# EAGLE design CANBUS Breakout Board (EAGLE 9.6.2)
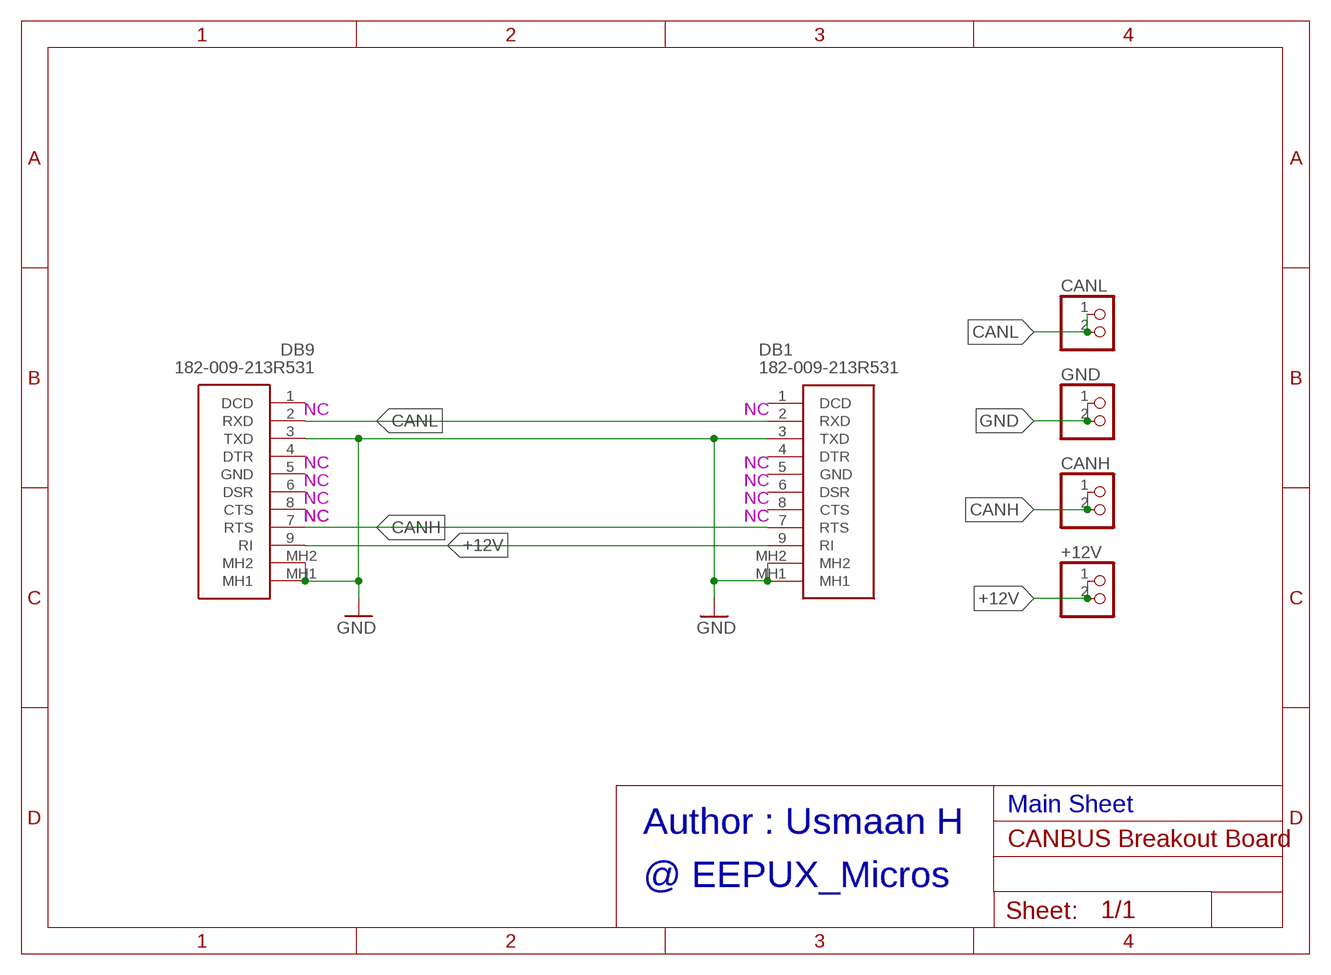
[diagram p0: schematic, sheet 1]

## Parts
+12V  PINHD-1X2  [1X02]
CANH  PINHD-1X2  [1X02]
CANL  PINHD-1X2  [1X02]
DB1  182-009-213R531  [182009213R531]
DB9  182-009-213R531  [182009213R531]
GND  PINHD-1X2  [1X02]

## Nets
+12V: +12V.1 +12V.2 DB1.9(RI) DB9.9(RI)
CANH: CANH.1 CANH.2 DB1.7(RTS) DB9.7(RTS)
CANL: CANL.1 CANL.2 DB1.2(RXD) DB9.2(RXD)
GND [pwr]: DB1.3(TXD) DB1.MH1 DB1.MH2 DB9.3(TXD) DB9.MH1 DB9.MH2 GND.1 GND.2
Unconnected: DB1.1(DCD) DB1.4(DTR) DB1.5(GND) DB1.6(DSR) DB1.8(CTS) DB9.1(DCD) DB9.4(DTR) DB9.5(GND) DB9.6(DSR) DB9.8(CTS)

## Notes on the sheet
- NC | NC
- NC | NC
- NC | NC
- NC | NC
- NC | NC | NC
- Main Sheet
- Author : Usmaan H
- @ EEPUX_Micros

## Library data of the parts
+12V CANH CANL GND = pinhead:PINHD-1X2: PIN HEADER
DB1 DB9 = 182-009-213R531:182-009-213R531: Norcomp 9 Way Right Angle PCB D-sub Connector Socket, 2.77mm Pitch, with 4-40 Flush Insert/Board Lock Source: Datasheet <https://componentsearchengine.com/Datasheets/2/182-009-213R531.pdf>; DESCRIPTION: Norcomp 9 Way Right Angle PCB D-sub Connector Socket, 2.77mm Pitch, with 4-40 Flush Insert/Board Lock; HEIGHT: 12.55mm; MANUFACTURER_NAME: NorComp; MANUFACTURER_PART_NUMBER: 182-009-213R531; MOUSER_PART_NUMBER: 636-182-009-213R531; MOUSER_PRICE-STOCK: https://www.mouser.com/Search/Refine.aspx?Keyword=636-182-009-213R531; RS_PART_NUMBER: 1748825; RS_PRICE-STOCK: http://uk.rs-online.com/web/p/products/1748825

## Net classes
0 default: drill 0.254 mm, clearance 0.127 mm
1 pwr: drill 0.254 mm, clearance 0.127 mm
2 HDMI//SATA: width 0.127 mm, drill 0.254 mm, clearance 0.127 mm
3 USB: width 0.127 mm, drill 0.254 mm, clearance 0.127 mm

## Board
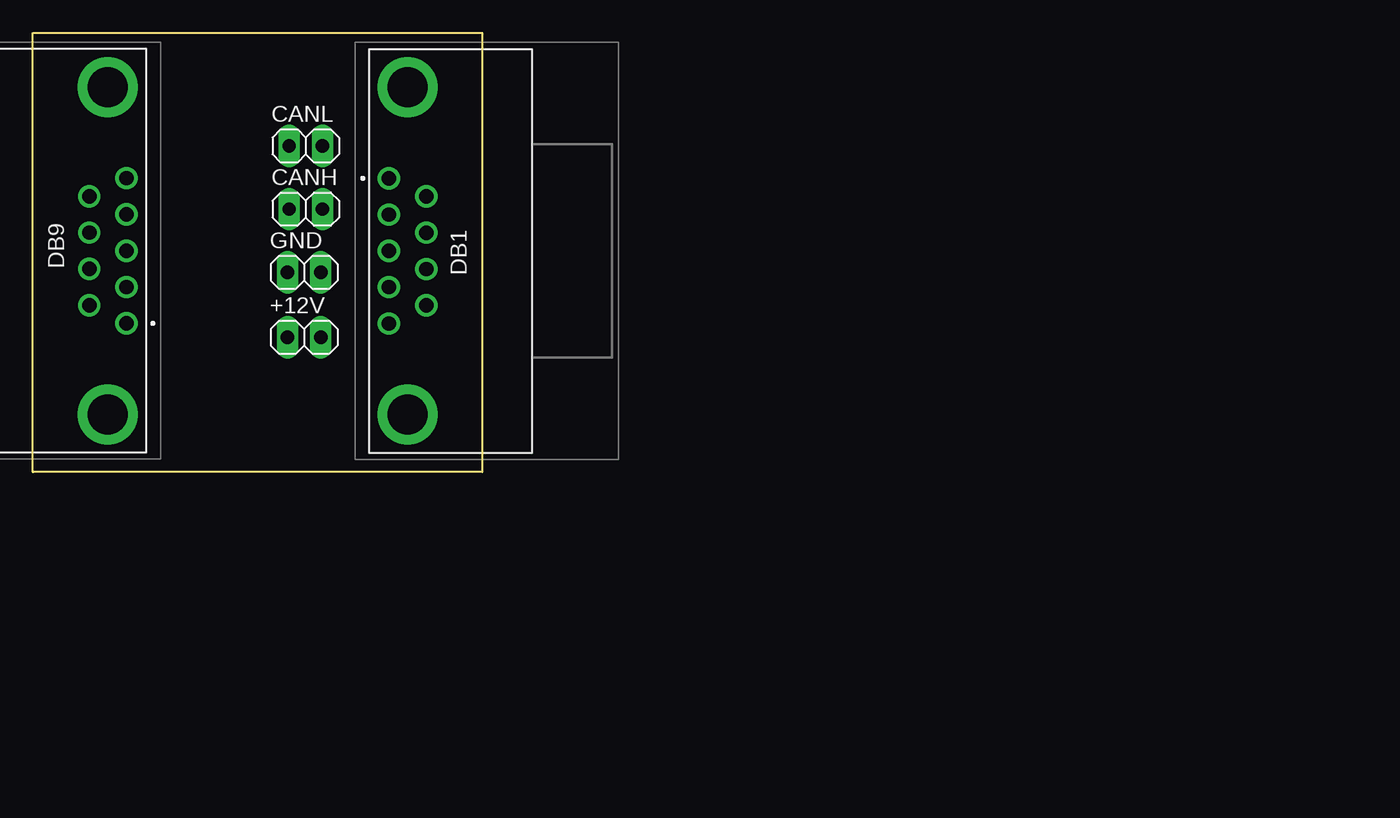
[diagram p1: board, top side]
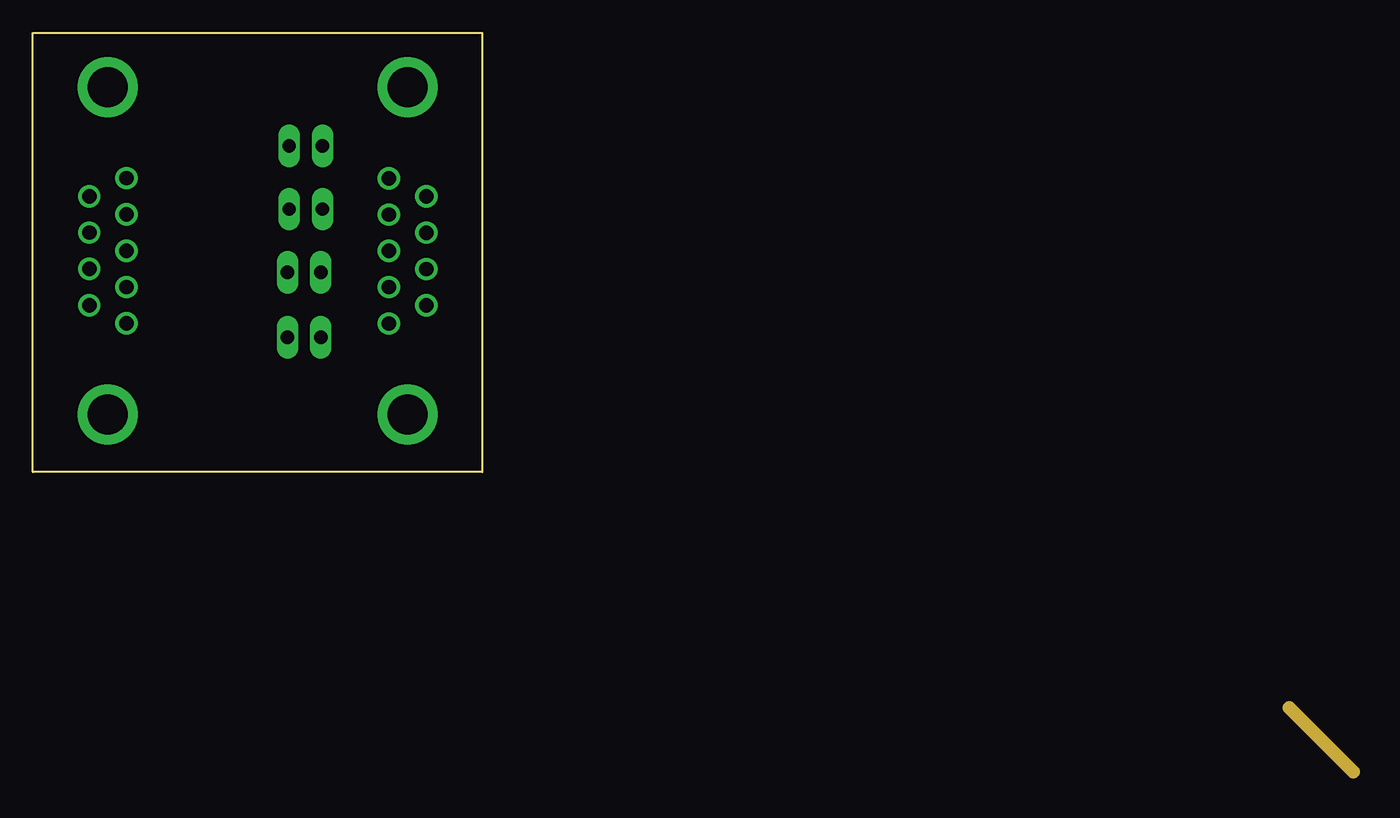
[diagram p2: board, inner layer Route15]
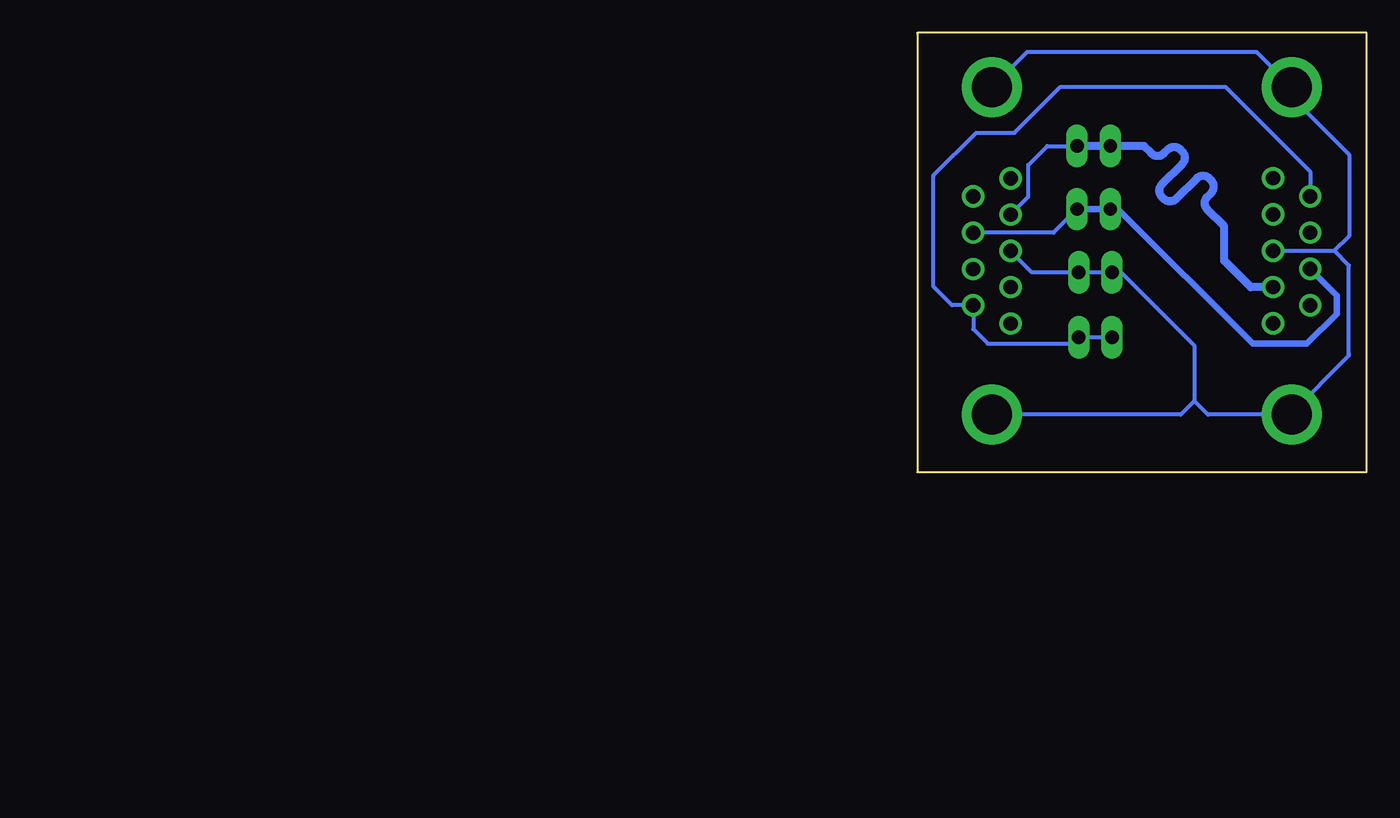
[diagram p3: board, bottom side, seen from below]

Size 34.29 x 33.53 mm. Coordinates in mm from the lower left corner, seen from the top.
Outline: 0,0 0,33.53 34.29,33.53 34.29,0 0,0
Copper layers (1*16): Top 0.035mm / dielectric 1.5mm / Bottom 0.035mm
Design rules "CU_MITS_DesignRules": minimum track width 12mil, minimum drill 23mil, track to track 12mil, track to pad 12mil, pad to pad 12mil, via to via 12mil, smd to smd 0mil, copper to edge 40mil, drill to drill 12mil, minimum pad ring 12mil, minimum via ring 6mil, stop-mask expansion 2mil, vias tented up to drill 100mil, thermal gap 12mil

### Footprints (pad centres in the part's own frame; a part is rotated, then mirrored left to right if it is on the bottom)
1X02 = drill 1.016 long: 1 -1.27,0; 2 1.27,0
182009213R531 = drill 1.09 pad 1.635: 1 0,0; 2 -2.77,0; 3 -5.54,0; 4 -8.31,0; 5 -11.08,0; 6 -1.385,-2.84; 7 -4.155,-2.84; 8 -6.925,-2.84; 9 -9.695,-2.84 | drill 3.05 pad 4.575: MH1 6.955,-1.42; MH2 -18.035,-1.42

### Placement (x,y rotation side)
+12V  20.7,10.29 0 top
CANH  20.83,20.07 0 top
CANL  20.83,24.89 0 top
DB1  27.18,22.42 90 top
DB9  7.15,11.35 270 top
GND  20.7,15.24 0 top

### Tracks (layer width: path | path; a pad name or v marks a point on that pad's centre or on a via)
+5V1
  Route15 1.016: 100.75,-22.88 95.87,-18
+12V
  Bottom 0.305: +12V.1 +12V.2 22.46,9.8 28.9,9.8 30.02,10.91 DB1.9 31.63,12.73 33.05,14.14 33.05,22.65 29.79,25.9 26.86,25.9 23.36,29.4 16.2,29.4 | DB9.9 4.31,22.93 10.78,29.4 16.2,29.4 | 16.2,29.4
CANH
  Bottom 0.305: DB1.7 23.89,18.27 CANH.2
  Bottom 0.508: DB9.7 2.3,13.49 2.3,12.07 4.58,9.8 8.7,9.8 18.97,20.07 CANH.1 CANH.2
CANL
  Bottom 0.305: DB1.2 25.83,21.01 25.83,23.44 24.38,24.89 CANL.2
  Bottom 0.61: DB9.2 8.84,14.12 10.87,16.14 10.87,18.76 12.16,20.05 arc90 12.16,21.02 11.87,21.31 arc-90 11.87,22.28 12,22.41 arc-90 12.97,22.41 14.52,20.86 arc90 15.49,20.86 15.62,21 arc90 15.62,21.97 14.08,23.51 arc-90 14.08,24.48 14.21,24.61 arc-90 15.18,24.61 15.47,24.33 arc90 16.44,24.33 17,24.89 CANL.1 CANL.2 22.19,24.89
GND
  Bottom 0.305: 1.35,9.04 1.36,9.05 | DB1.MH1 25.91,32.07 8.42,32.07 DB9.MH2 5.73,28.6 1.34,24.21 1.34,18.02 2.47,16.89 | DB1.MH2 14.2,4.4 13.16,5.44 | 13.16,5.44 13.16,9.66 18.73,15.24 GND.1 GND.2 25.53,15.24 DB1.3 | DB9.3 2.47,16.89 | 1.35,9.04 1.35,8.9 5.73,4.52 DB9.MH1 12.11,4.4 13.16,5.44 | 1.35,9.04 1.35,15.78 2.47,16.89
  cutout Bottom: -5.08,-2.54 -5.08,35.56 40.2,35.56 40.2,-2.54